# Altium schematic sheet Schematic1.SchDoc
size A
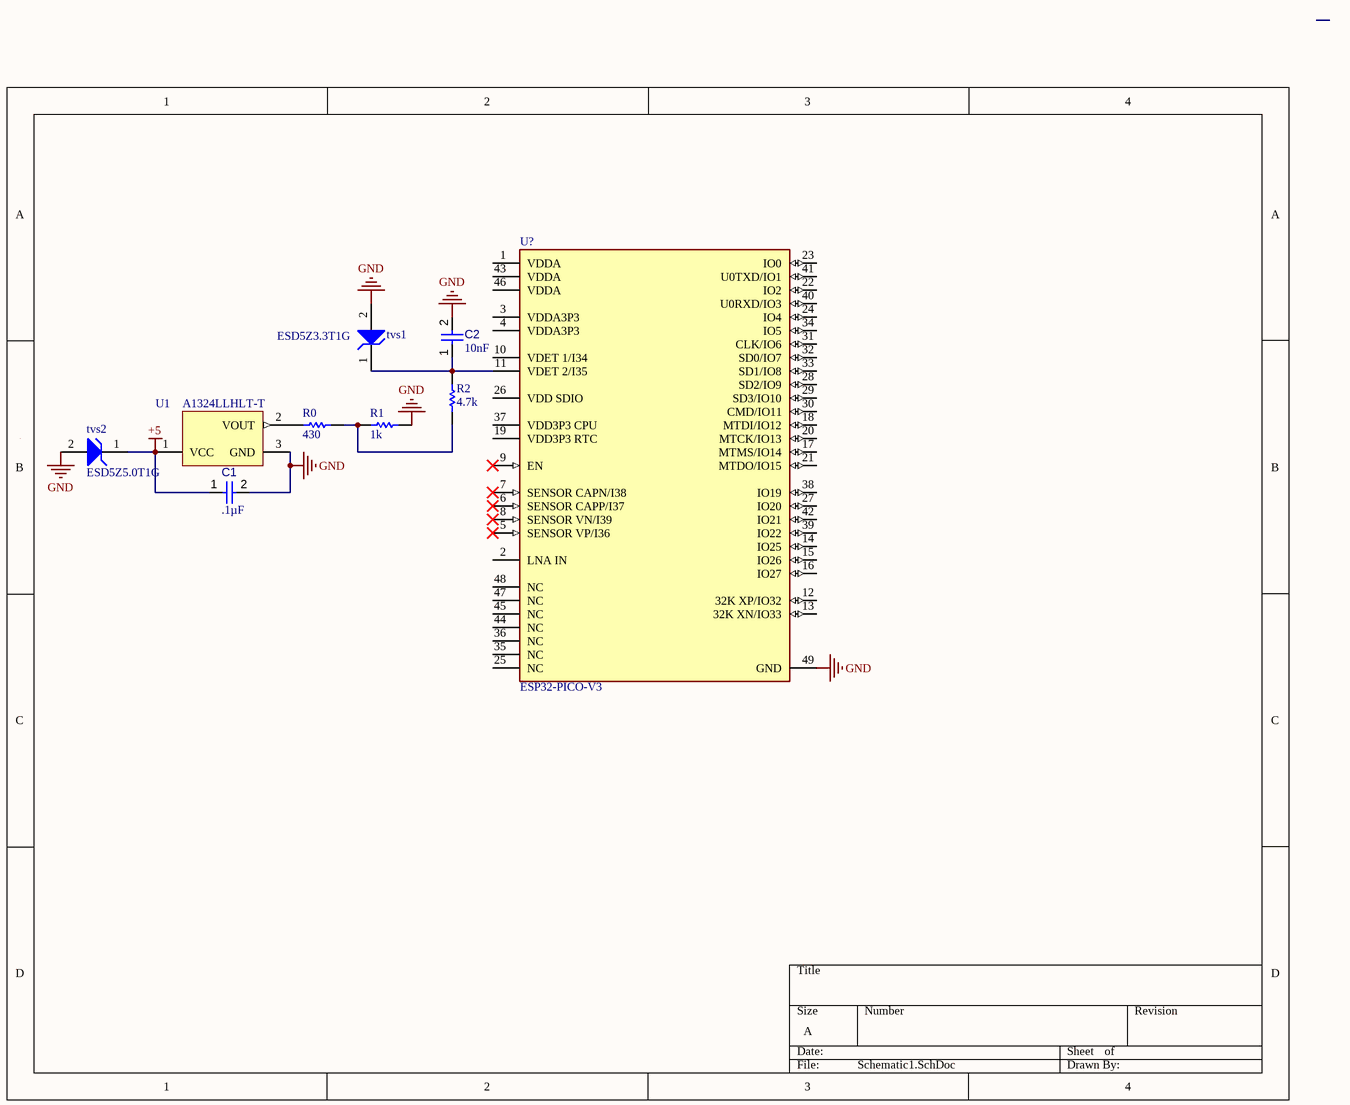
[diagram p0: Schematic1.SchDoc]

## Parts
C1  value .1µF  [CAPC0603(1608)100_L]  (hidden comment: Capacitor 1µF +/-0.1% 25V 0603)
C2  value 10nF  [CAPC0603(1608)100_L]  (hidden comment: Capacitor 1µF +/-0.1% 25V 0603)
R0  value 430  (hidden comment: Resistor)
R1  value 1k  (hidden comment: Resistor)
R2  value 4.7k  (hidden comment: Resistor)
tvs1  ESD5Z3.3T1G  [ONSC-SOD-523-2-502-01_V]
tvs2  ESD5Z5.0T1G  [ONSC-SOD-523-2-502-01_V]
U1  A1324LLHLT-T  [ALEG-SOT23W-3_V]
U?  ESP32-PICO-V3  [FP-ESP32-PICO-V3-MFG]

## Nets
+5: C1.1 tvs2.1(K) U1.1(VCC)
GND: C1.2 C2.2 R1.1 tvs1.2(A) tvs2.2(A) U1.3(GND) U?.49(GND)
NetC2_1: C2.1 R2.2 tvs1.1(K) U?.11(VDET_2/I35)
NetR0_1: R0.1 R1.2 R2.1
NetR0_2: R0.2 U1.2(VOUT)

Not connected (* = marked no-connect by the designer): U? 1(VDDA) 2(LNA_IN) 3(VDDA3P3) 4(VDDA3P3) 5(SENSOR_VP/I36)* 6(SENSOR_CAPP/I37)* 7(SENSOR_CAPN/I38)* 8(SENSOR_VN/I39)* 9(EN)* 10(VDET_1/I34) 12(32K_XP/IO32) 13(32K_XN/IO33) 14(IO25) 15(IO26) 16(IO27) 17(MTMS/IO14) 18(MTDI/IO12) 19(VDD3P3_RTC) 20(MTCK/IO13) 21(MTDO/IO15) 22(IO2) 23(IO0) 24(IO4) 25(NC) 26(VDD_SDIO) 27(IO20) 28(SD2/IO9) 29(SD3/IO10) 30(CMD/IO11) 31(CLK/IO6) 32(SD0/IO7) 33(SD1/IO8) 34(IO5) 35(NC) 36(NC) 37(VDD3P3_CPU) 38(IO19) 39(IO22) 40(U0RXD/IO3) 41(U0TXD/IO1) 42(IO21) 43(VDDA) 44(NC) 45(NC) 46(VDDA) 47(NC) 48(NC)

## Library data of the parts
C1 C2 = CMP-001-00055-4: Chip Capacitor, 1µF +/-0.1%, 25V, 0603, Thickness 1 mm; Tolerance: 20%; Min Operating Temperature: -55°C; Max Operating Temperature: 85°C; Voltage Rating: 25V; Mounting Technology: SMT; Case/Package: 0603; Pins: 2
R0-R2 = Resistor: TC1: 0; SimulationGenericComponent: True; TC2: 0
tvs1 = CMP-1063-00098-1: Transient Voltage Suppressor, Micro-Packaged Diode for ESD Protection, 2-Pin SOD-523, Pb-Free, Tape and Reel; Manufacturer: On Semiconductor; VRWM Max (V): 3.3; Number of Lines: 1; V(BR) Min (V): 5; PPK Max (W): 158; Direction: Unidirectional; IR Max (uA): 0.05; PackageReference: SOD-523-2-502-01; PackageVersion: Rev. E, 09/2010; RoHS: Pb-Free; ComponentLink3Description: Package Specification; Packing: Tape and Reel; ComponentLink1URL: http://www.onsemi.com/; DatasheetVersion: Rev. 10; ComponentLink2Description: Datasheet; Mounting Technology: Surface Mount; ComponentLink2URL: http://www.onsemi.cn/pub_link/Collateral/ESD5Z2.5T1-D.PDF; PartNumber: ESD5Z3.3T1G; PackageDescription: 2-Pin SOD, Body 1.2 x 0.8 mm; ComponentLink3URL: http://www.onsemi.com/pub_link/Collateral/502-01.PDF; ComponentLink1Description: Manufacturer URL
tvs2 = CMP-1063-00102-1: Transient Voltage Suppressor, Micro-Packaged Diode for ESD Protection, 2-Pin SOD-523, Pb-Free, Tape and Reel; Manufacturer: On Semiconductor; V(BR) Min (V): 6.2; VRWM Max (V): 5; Number of Lines: 1; PPK Max (W): 174; IR Max (uA): 0.05; Direction: Unidirectional; PackageVersion: Rev. E, 09/2010; Mounting Technology: Surface Mount; Packing: Tape and Reel; ComponentLink2URL: http://www.onsemi.cn/pub_link/Collateral/ESD5Z2.5T1-D.PDF; ComponentLink2Description: Datasheet; PackageReference: SOD-523-2-502-01; ComponentLink1Description: Manufacturer URL; ComponentLink3URL: http://www.onsemi.com/pub_link/Collateral/502-01.PDF; PackageDescription: 2-Pin SOD, Body 1.2 x 0.8 mm; ComponentLink3Description: Package Specification; ComponentLink1URL: http://www.onsemi.com/; RoHS: Pb-Free; PartNumber: ESD5Z5.0T1G; DatasheetVersion: Rev. 10
U1 = CMP-010-00007-3: Low Noise, Linear Hall Effect Sensor IC with Analog Output, 4.5 to 5.5 V, -40 to 150 degC, 3-Pin SOT23, RoHS, Tape and Reel; Manufacturer: Allegro Microsystems; Nominal Supply Voltage: 5V; Max Supply Voltage: 5.5V; Min Supply Voltage: 4.5V; Package Quantity: 3000; Packaging: TapeandReel; Pins: 3; Case/Package: SOT23W-3; Min Operating Temperature: -40°C; Datasheet URL: http://www.allegromicro.com/en/Products/Part_Numbers/1324/1324.pdf; Max Operating Temperature: 150°C; Package Description: 3-Pin Small Outline Transistor, Body 3 x 1.975 mm, Pitch 0.95 mm; Datasheet Version: Rev. 4, 09/2013; Package Reference: SOT23W-3; Mounting Technology: SM; Sensor Type: Hall; RoHS Compliant: True
U? = CMP-194065-000030-1: RX TXRX MOD WIFI SURFACE MOUNT